# EAGLE schematic MSP-EXP430F5529LP (EAGLE 6.4)

## Sheet 1 of 4
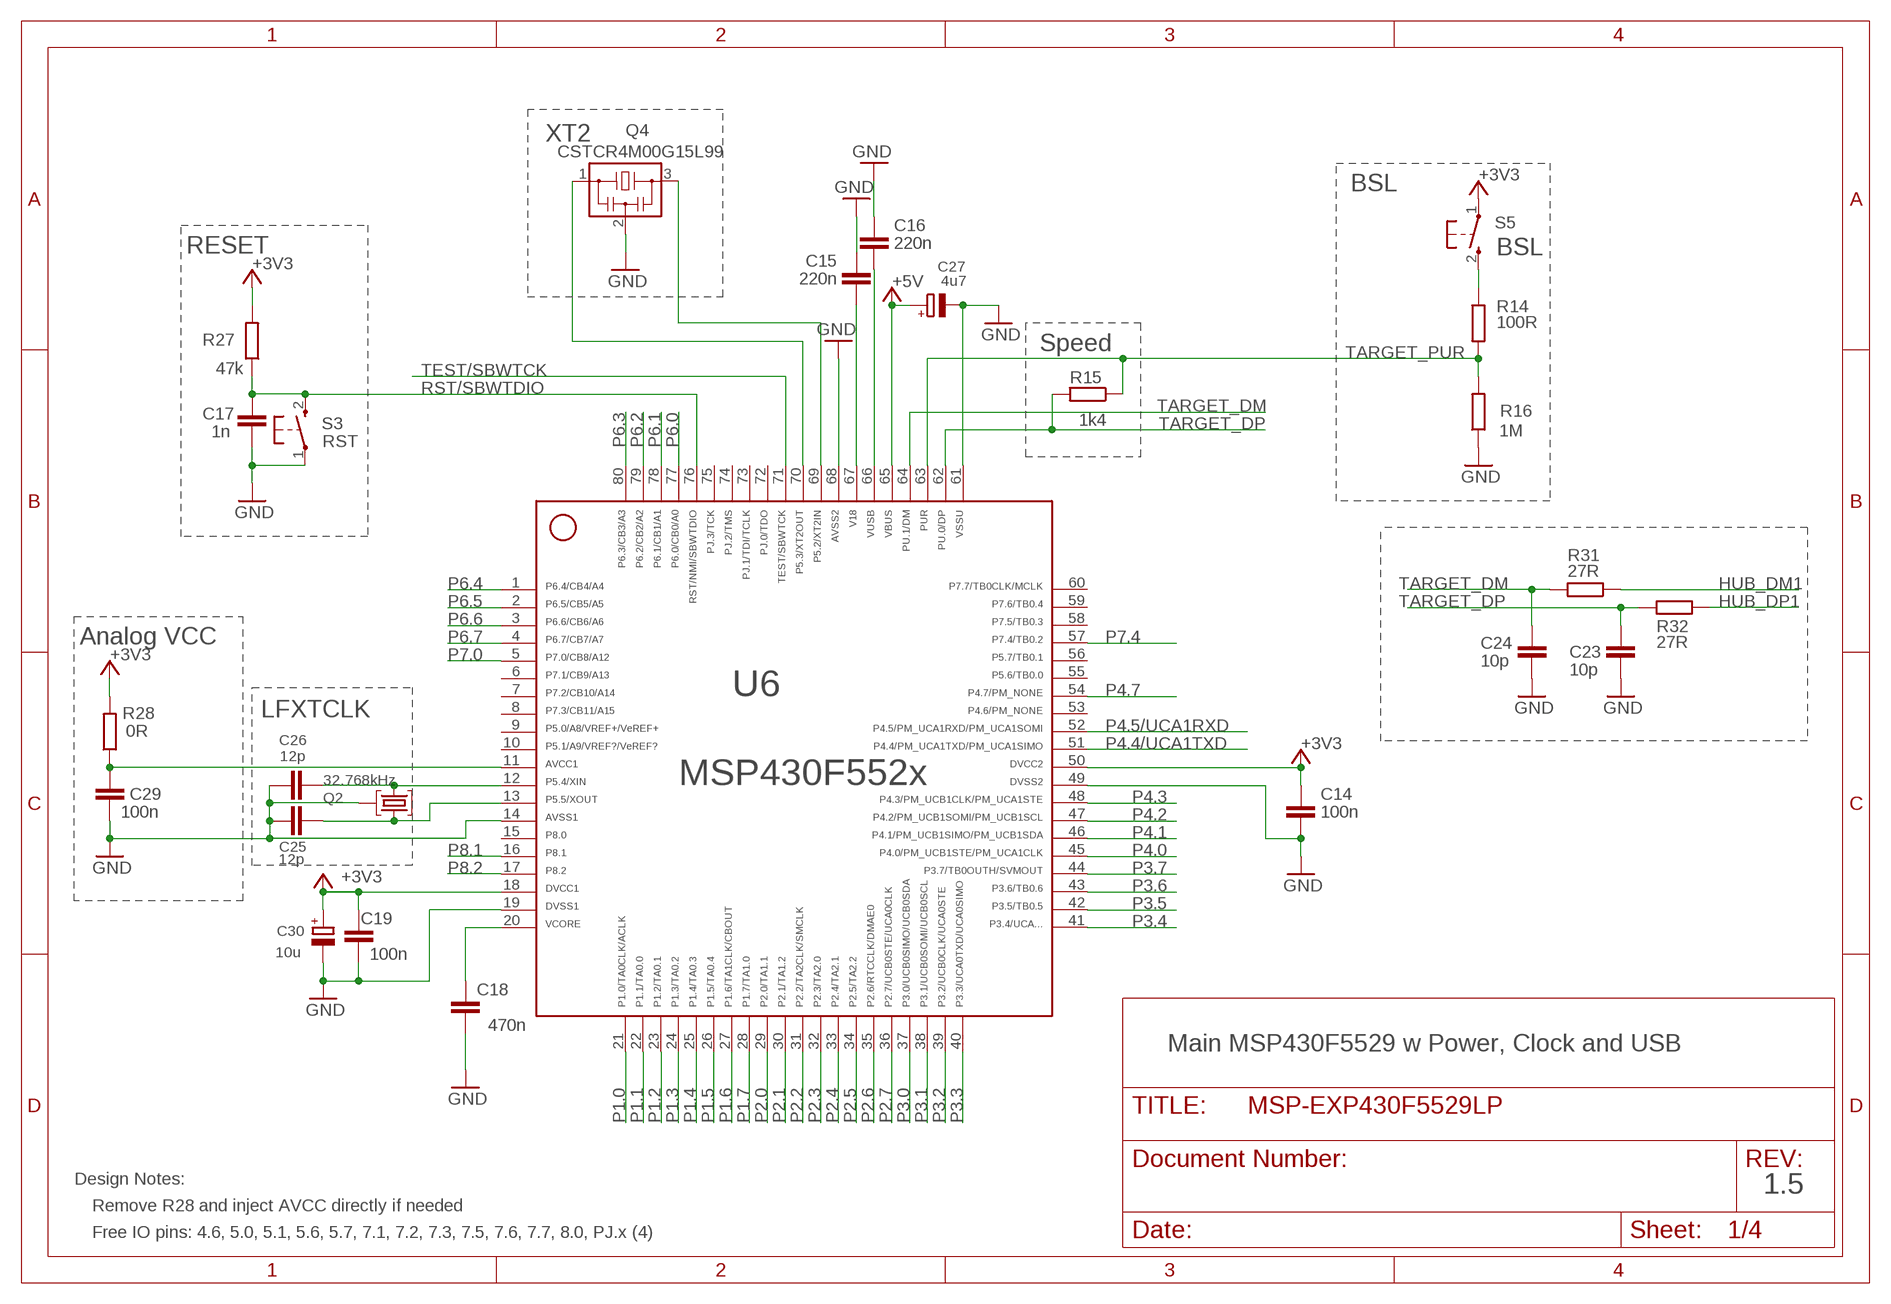
[diagram p0: schematic, sheet 1]

### Parts
C14  100n  C-EUC0402  [C0402]
C15  220n  C-EUC0402  [C0402]
C16  220n  C-EUC0402  [C0402]
C17  1n  C-EUC0402  [C0402]
C18  470n  C-EUC0402  [C0402]
C19  100n  C-EUC0402  [C0402]
C23  10p  C-EUC0402  [C0402]
C24  10p  C-EUC0402  [C0402]
C25  12p  C-EUC0402  [C0402]
C26  12p  C-EUC0402  [C0402]
C27  4u7  CPOL-EUA/3216-18R  [A/3216-18R]
C29  100n  C-EUC0402  [C0402]
C30  10u  CPOL-EUA/3216-18R  [A/3216-18R]
Q2  32.768kHz  MS3V-T1R  [MS3V-T1R]
Q4  CSTCR4M00G15L99  MURATA-FILTER_CSTCR6M00G53Z  [MURATA-FILTER_CSTCR]
R14  100R  R-EU_R0402  [R0402]
R15  1k4  R-EU_R0402  [R0402]
R16  1M  R-EU_R0402  [R0402]
R27  47k  R-EU_R0402  [R0402]
R28  0R  R-EU_R0402  [R0402]
R31  27R  R-EU_R0402  [R0402]
R32  27R  R-EU_R0402  [R0402]
S3  RST  PB  [PBTH]
S5  BSL  PB  [PBTH]
U6  MSP430F5529IPNR  F552X---PN80  [PN80]

### Nets
+3V3 [Power]: C14.1 C19.2 C30.+ R27.2 R28.2 S5.1(P) U6.18 U6.50 ; also sheet 2
+5V [Power]: C27.+ U6.65 ; also sheet 2
AVCC [Power]: C29.1 R28.1 U6.11
GND [Ground]: C14.2 C15.2 C16.2 C17.2 C18.1 C19.1 C23.2 C24.2 C25.1 C26.1 C27.- C29.2 C30.- Q2.P3(GND) Q4.2 R16.1 S3.1(P) U6.14 U6.19 U6.49 U6.61 U6.68 ; also sheet 2,3,4
HUB_DM1: R31.1 ; also sheet 4
HUB_DP1: R32.1 ; also sheet 4
N$4: R14.1 S5.2(S)
P1.0: U6.21 ; also sheet 2
P1.1: U6.22 ; also sheet 2
P1.2: U6.23 ; also sheet 2
P1.3: U6.24 ; also sheet 2
P1.4: U6.25 ; also sheet 2
P1.5: U6.26 ; also sheet 2
P1.6: U6.27 ; also sheet 2
P1.7: U6.28 ; also sheet 2
P2.0: U6.29 ; also sheet 2
P2.1: U6.30 ; also sheet 2
P2.2: U6.31 ; also sheet 2
P2.3: U6.32 ; also sheet 2
P2.4: U6.33 ; also sheet 2
P2.5: U6.34 ; also sheet 2
P2.6: U6.35 ; also sheet 2
P2.7: U6.36 ; also sheet 2
P3.0: U6.37 ; also sheet 2
P3.1: U6.38 ; also sheet 2
P3.2: U6.39 ; also sheet 2
P3.3: U6.40 ; also sheet 2
P3.4: U6.41 ; also sheet 2
P3.5: U6.42 ; also sheet 2
P3.6: U6.43 ; also sheet 2
P3.7: U6.44 ; also sheet 2
P4.0: U6.45 ; also sheet 2
P4.1: U6.46 ; also sheet 2
P4.2: U6.47 ; also sheet 2
P4.3: U6.48 ; also sheet 2
P4.4/UCA1TXD: U6.51 ; also sheet 2
P4.5/UCA1RXD: U6.52 ; also sheet 2
P4.7: U6.54 ; also sheet 2
P5.2/XT2IN: Q4.3 U6.69
P5.3/XT2OUT: Q4.1 U6.70
P5.4/XIN: C26.2 Q2.P2 U6.12
P5.5/XOUT: C25.2 Q2.P1 U6.13
P6.0: U6.77 ; also sheet 2
P6.1: U6.78 ; also sheet 2
P6.2: U6.79 ; also sheet 2
P6.3: U6.80 ; also sheet 2
P6.4: U6.1 ; also sheet 2
P6.5: U6.2 ; also sheet 2
P6.6: U6.3 ; also sheet 2
P6.7: U6.4 ; also sheet 2
P7.0: U6.5 ; also sheet 2
P7.4: U6.57 ; also sheet 2
P8.1: U6.16 ; also sheet 2
P8.2: U6.17 ; also sheet 2
RST/SBWTDIO: C17.1 R27.1 S3.2(S) U6.76 ; also sheet 2
TARGET_DM: C24.1 R31.2 U6.64
TARGET_DP: C23.1 R15.2 R32.2 U6.62
TARGET_PUR: R14.2 R15.1 R16.2 U6.63
TARGET_VUSB [Power]: C16.1 U6.66
TEST/SBWTCK: U6.71 ; also sheet 2
V18 [Power]: C15.1 U6.67
VCORE [Power]: C18.2 U6.20
Unconnected: U6.6 U6.7 U6.8 U6.9 U6.10 U6.15 U6.53 U6.55 U6.56 U6.58 U6.59 U6.60 U6.72 U6.73 U6.74 U6.75

### Notes on the sheet
- XT2
- BSL
- RESET
- Speed
- Analog VCC
- LFXTCLK
- Main MSP430F5529 w Power, Clock and USB
- Design Notes:
- 1.5
- Remove R28 and inject AVCC directly if needed
- Free IO pins: 4.6, 5.0, 5.1, 5.6, 5.7, 7.1, 7.2, 7.3, 7.5, 7.6, 7.7, 8.0, PJ.x (4)

## Sheet 2 of 4
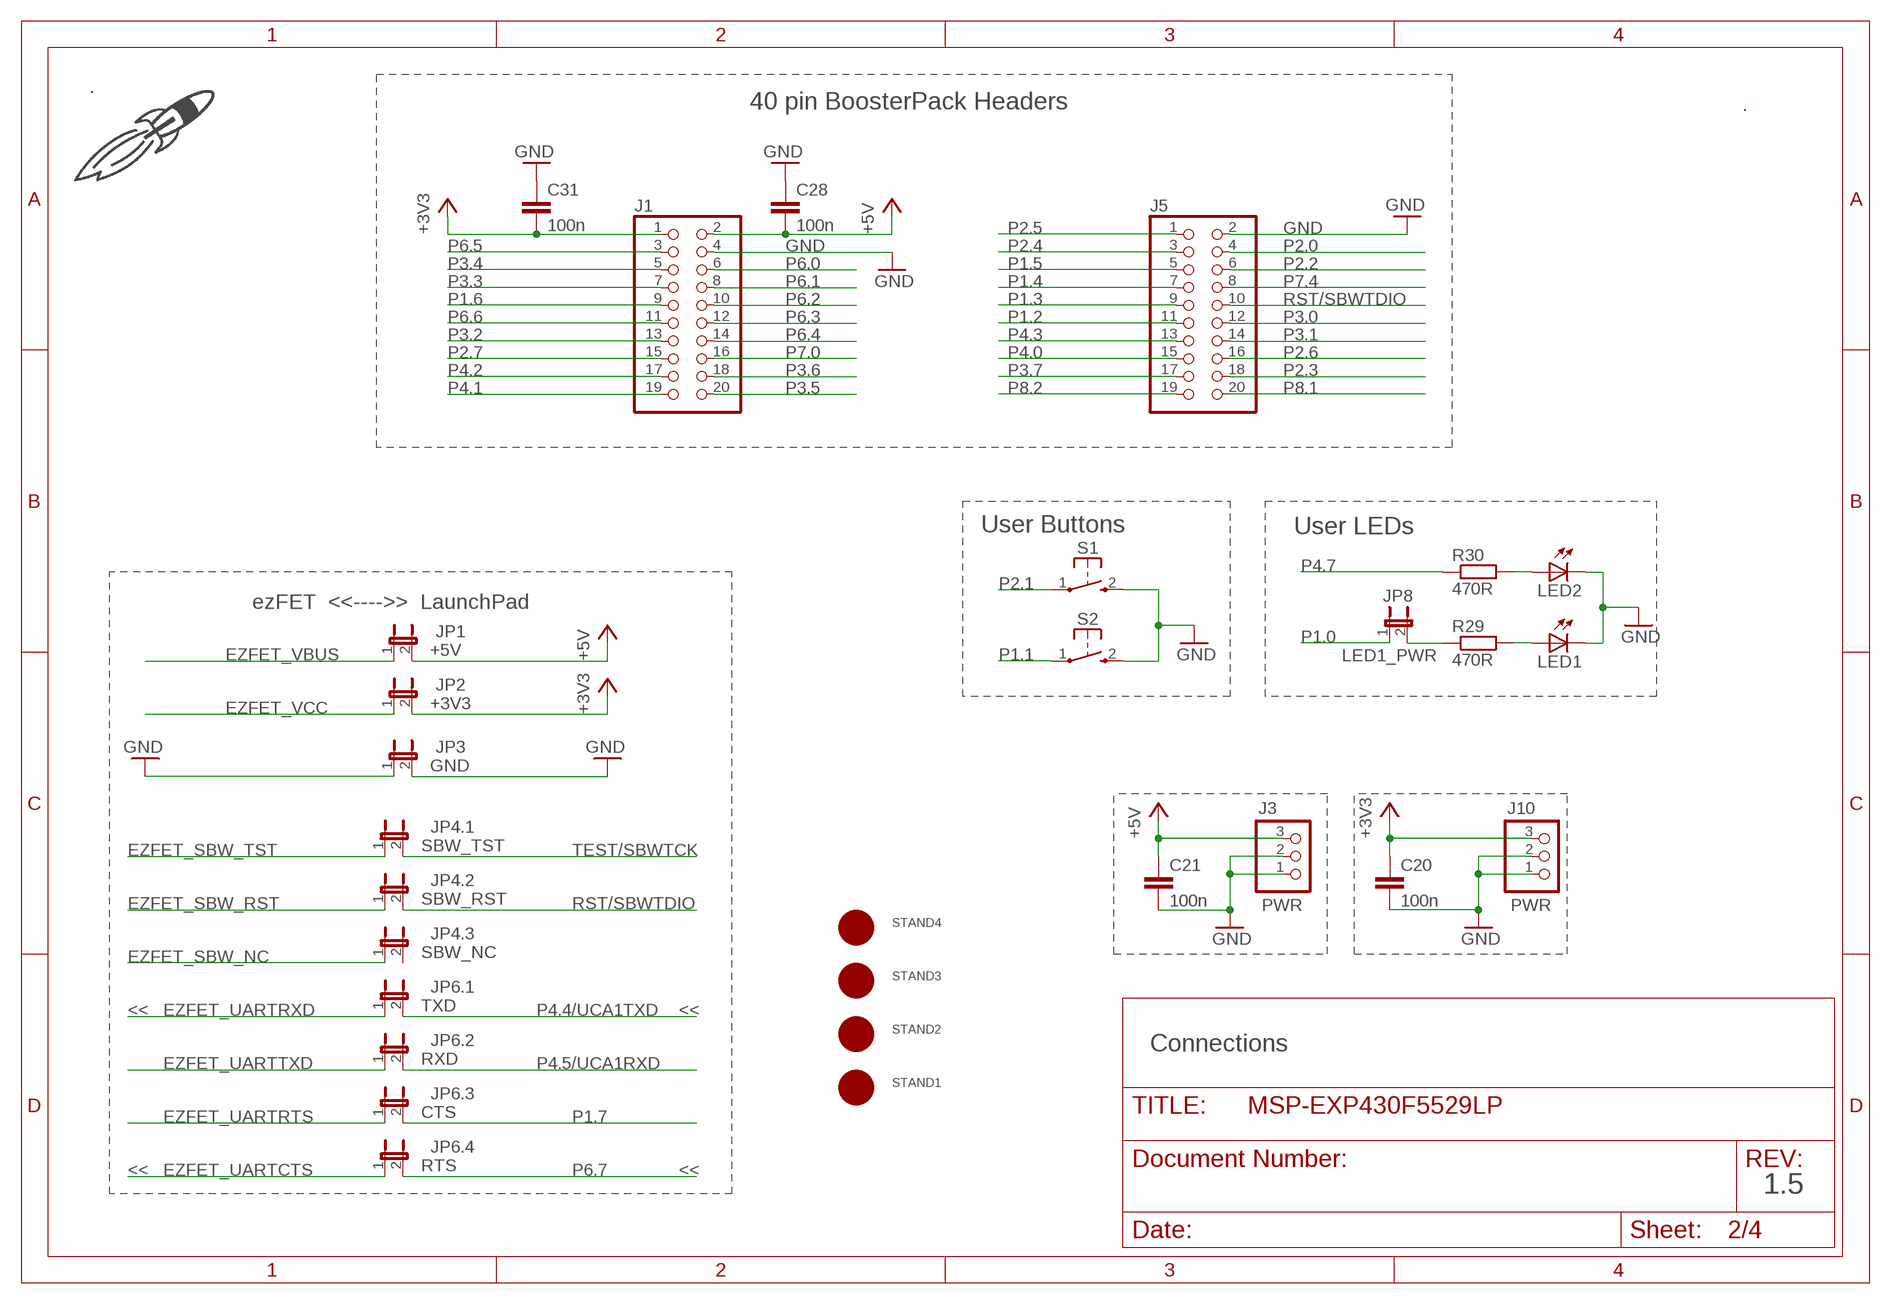
[diagram p1: schematic, sheet 2]

### Parts
C20  100n  C-EUC0402  [C0402]
C21  100n  C-EUC0402  [C0402]
C28  100n  C-EUC0402  [C0402]
C31  100n  C-EUC0402  [C0402]
DRAW1  LOGO-ROCKET-20X13MM-SCH-S  [LOGO-ROCKET-10X7MM-BRD]
J1  PINHD-2X10  [2X10]
J3  PWR  PINHD-1X3  [1X03]
J5  PINHD-2X10  [2X10]
J10  PWR  PINHD-1X3  [1X03]
JP1  +5V  JP1M  [JP1M]
JP2  +3V3  JP1M  [JP1M]
JP3  GND  JP1M  [JP1M]
JP4.1  SBW_TST  JP1M  [JP1M]
JP4.2  SBW_RST  JP1M  [JP1M]
JP4.3  SBW_NC  JP1M  [JP1M]
JP6.1  TXD  JP1M  [JP1M]
JP6.2  RXD  JP1M  [JP1M]
JP6.3  CTS  JP1M  [JP1M]
JP6.4  RTS  JP1M  [JP1M]
JP8  LED1_PWR  JP1E  [JP1]
LED1  LEDCHIPLED_0603  [CHIPLED_0603]
LED2  LEDCHIPLED_0603  [CHIPLED_0603]
R29  470R  R-EU_R0402  [R0402]
R30  470R  R-EU_R0402  [R0402]
S1  PB  [PBTH]
S2  PB  [PBTH]
STAND1  MOUNT  [MOUNTHOLE_110MIL]
STAND2  MOUNT  [MOUNTHOLE_110MIL]
STAND3  MOUNT  [MOUNTHOLE_110MIL]
STAND4  MOUNT  [MOUNTHOLE_110MIL]
U$3  5529_REAR_SILK_REV1_5_FINAL  [5529_REAR_SILK_REV1_5_FINAL]
U$4  MS_TM  [MS_TM]

### Nets
+3V3 [Power]: C20.1 C31.2 J1.1 J10.3 JP2.2 ; also sheet 1
+5V [Power]: C21.1 C28.2 J1.2 J3.3 JP1.2 ; also sheet 1
EZFET_SBW_NC: JP4.3.1 ; also sheet 3
EZFET_SBW_RST: JP4.2.1 ; also sheet 3
EZFET_SBW_TST: JP4.1.1 ; also sheet 3
EZFET_UARTCTS: JP6.4.1 ; also sheet 3
EZFET_UARTRTS: JP6.3.1 ; also sheet 3
EZFET_UARTRXD: JP6.1.1 ; also sheet 3
EZFET_UARTTXD: JP6.2.1 ; also sheet 3
EZFET_VBUS [Power]: JP1.1 ; also sheet 3,4
EZFET_VCC [Power]: JP2.1 ; also sheet 3,4
GND [Ground]: C20.2 C21.2 C28.1 C31.1 J1.4 J3.1 J3.2 J5.2 J10.1 J10.2 JP3.1 JP3.2 LED1.C LED2.C S1.2(S) S2.2(S) ; also sheet 1,3,4
N$7: JP8.2 R29.1
N$32: LED1.A R29.2
N$35: LED2.A R30.2
P1.0: JP8.1 ; also sheet 1
P1.1: S2.1(P) ; also sheet 1
P1.2: J5.11 ; also sheet 1
P1.3: J5.9 ; also sheet 1
P1.4: J5.7 ; also sheet 1
P1.5: J5.5 ; also sheet 1
P1.6: J1.9 ; also sheet 1
P1.7: JP6.3.2 ; also sheet 1
P2.0: J5.4 ; also sheet 1
P2.1: S1.1(P) ; also sheet 1
P2.2: J5.6 ; also sheet 1
P2.3: J5.18 ; also sheet 1
P2.4: J5.3 ; also sheet 1
P2.5: J5.1 ; also sheet 1
P2.6: J5.16 ; also sheet 1
P2.7: J1.15 ; also sheet 1
P3.0: J5.12 ; also sheet 1
P3.1: J5.14 ; also sheet 1
P3.2: J1.13 ; also sheet 1
P3.3: J1.7 ; also sheet 1
P3.4: J1.5 ; also sheet 1
P3.5: J1.20 ; also sheet 1
P3.6: J1.18 ; also sheet 1
P3.7: J5.17 ; also sheet 1
P4.0: J5.15 ; also sheet 1
P4.1: J1.19 ; also sheet 1
P4.2: J1.17 ; also sheet 1
P4.3: J5.13 ; also sheet 1
P4.4/UCA1TXD: JP6.1.2 ; also sheet 1
P4.5/UCA1RXD: JP6.2.2 ; also sheet 1
P4.7: R30.1 ; also sheet 1
P6.0: J1.6 ; also sheet 1
P6.1: J1.8 ; also sheet 1
P6.2: J1.10 ; also sheet 1
P6.3: J1.12 ; also sheet 1
P6.4: J1.14 ; also sheet 1
P6.5: J1.3 ; also sheet 1
P6.6: J1.11 ; also sheet 1
P6.7: JP6.4.2 ; also sheet 1
P7.0: J1.16 ; also sheet 1
P7.4: J5.8 ; also sheet 1
P8.1: J5.20 ; also sheet 1
P8.2: J5.19 ; also sheet 1
RST/SBWTDIO: J5.10 JP4.2.2 ; also sheet 1
TEST/SBWTCK: JP4.1.2 ; also sheet 1
Unconnected: JP4.3.2

### Notes on the sheet
- 40 pin BoosterPack Headers
- User Buttons | User LEDs
- ezFET  <<---->>  LaunchPad
- << | <<
- Connections
- << | <<
- 1.5

## Sheet 3 of 4
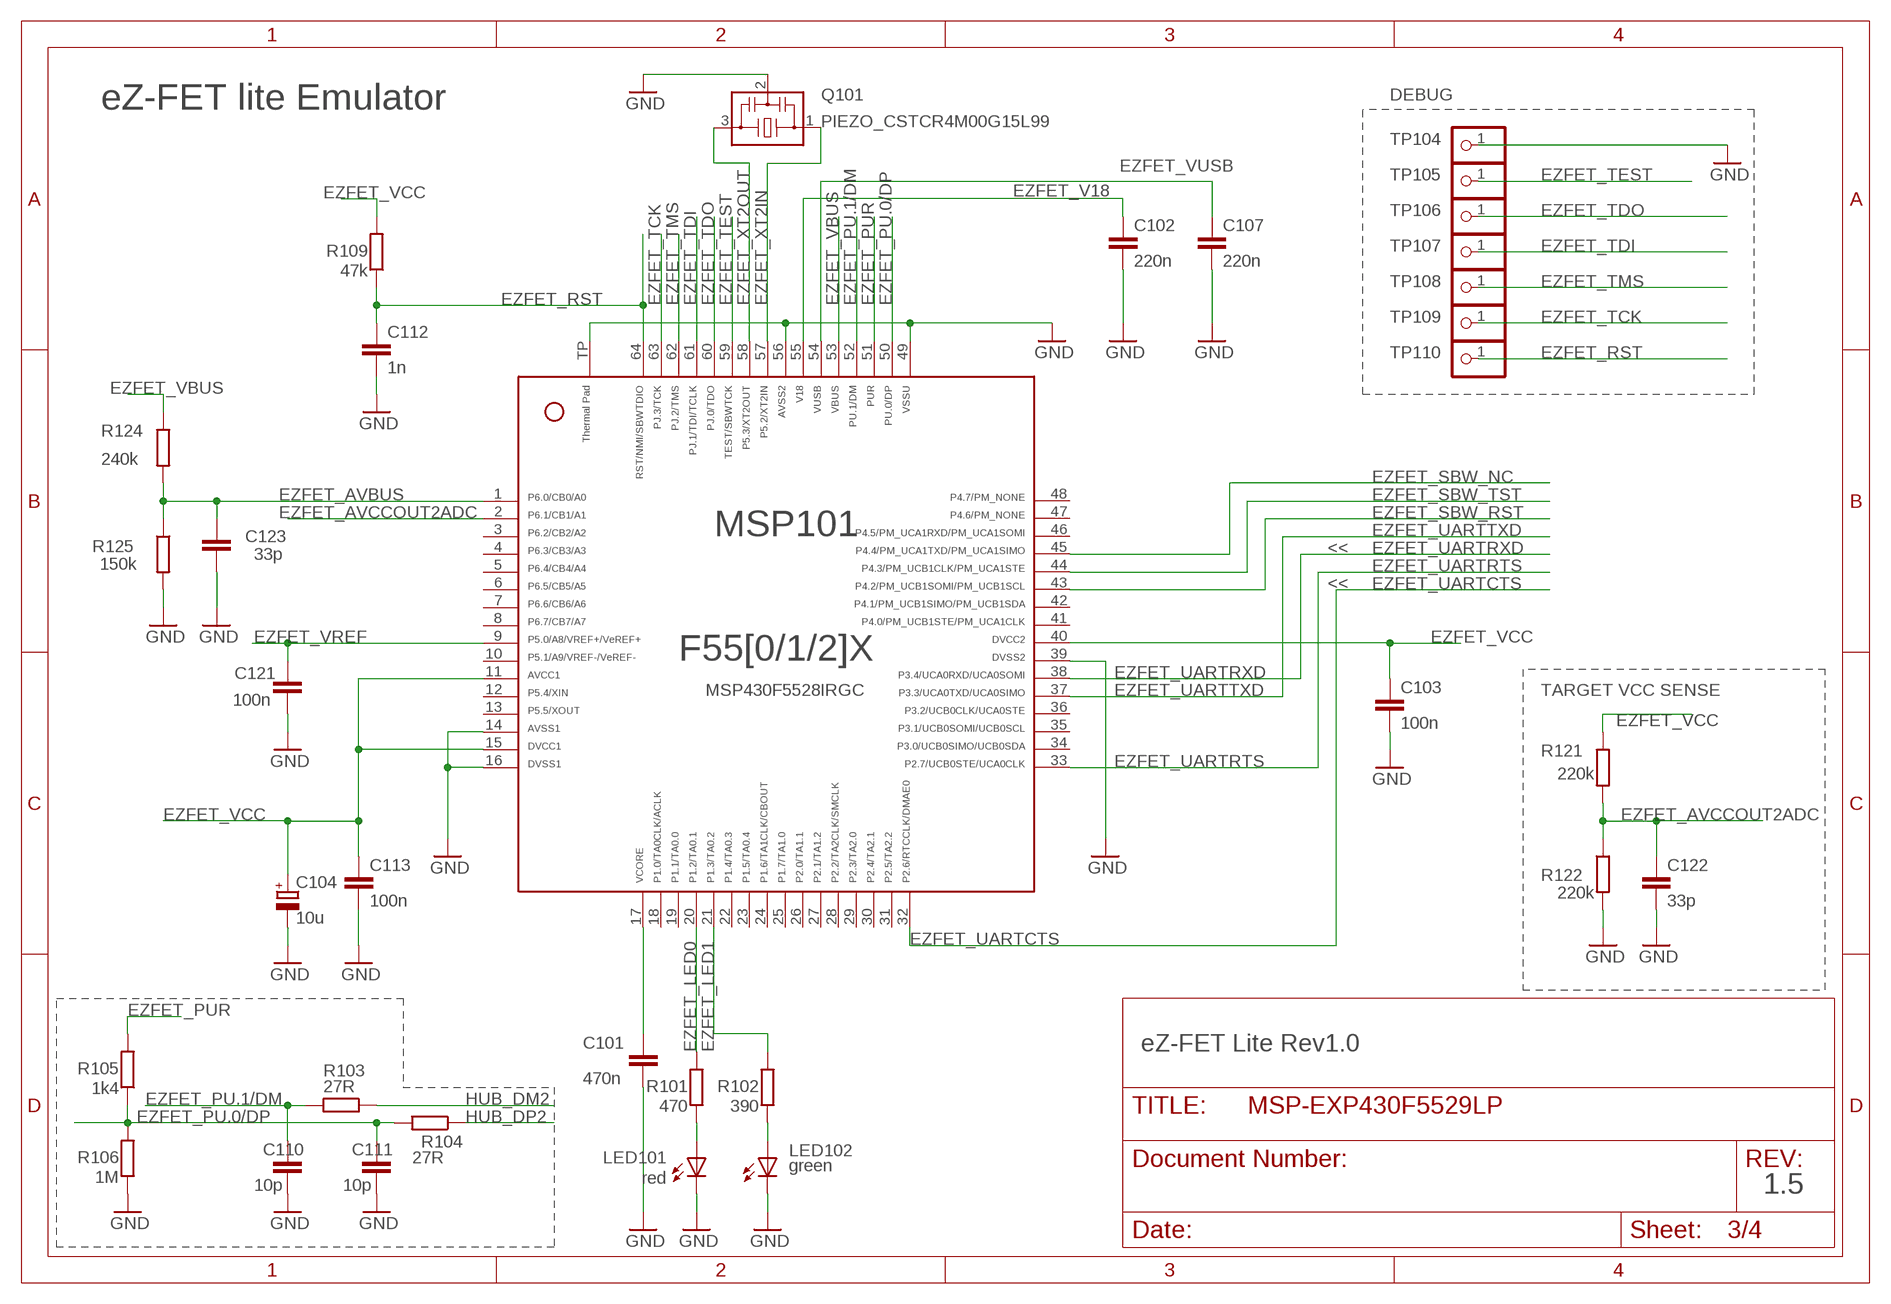
[diagram p2: schematic, sheet 3]

### Parts
C101  470n  C-EUC0402  [C0402]
C102  220n  C-EUC0402  [C0402]
C103  100n  C-EUC0402  [C0402]
C104  10u  CPOL-EUA/3216-18R  [A/3216-18R]
C107  220n  C-EUC0402  [C0402]
C110  10p  C-EUC0402  [C0402]
C111  10p  C-EUC0402  [C0402]
C112  1n  C-EUC0402  [C0402]
C113  100n  C-EUC0402  [C0402]
C121  100n  C-EUC0402  [C0402]
C122  33p  C-EUC0402  [C0402]
C123  33p  C-EUC0402  [C0402]
LED101  red  LEDCHIP-LED0603  [CHIP-LED0603]
LED102  green  LEDCHIP-LED0603  [CHIP-LED0603]
MSP101  MSP430F5528IRGC  F55[0/1/2]X---RGC64  [RGC64]
Q101  PIEZO_CSTCR4M00G15L99  MURATA-FILTER_CSTCR6M00G53Z  [MURATA-FILTER_CSTCR]
R101  470  R-EU_R0402  [R0402]
R102  390  R-EU_R0402  [R0402]
R103  27R  R-EU_R0402  [R0402]
R104  27R  R-EU_R0402  [R0402]
R105  1k4  R-EU_R0402  [R0402]
R106  1M  R-EU_R0402  [R0402]
R109  47k  R-EU_R0402  [R0402]
R121  220k  R-EU_R0402  [R0402]
R122  220k  R-EU_R0402  [R0402]
R124  240k  R-EU_R0402  [R0402]
R125  150k  R-EU_R0402  [R0402]
TP104  TEST_PIN2  PINHD-1X1  [1X01]
TP105  TEST_PIN2  PINHD-1X1  [1X01]
TP106  TEST_PIN2  PINHD-1X1  [1X01]
TP107  TEST_PIN2  PINHD-1X1  [1X01]
TP108  TEST_PIN2  PINHD-1X1  [1X01]
TP109  TEST_PIN2  PINHD-1X1  [1X01]
TP110  TEST_PIN2  PINHD-1X1  [1X01]

### Nets
EZFET_AVBUS: C123.2 MSP101.1 R124.2 R125.1
EZFET_AVCCOUT2ADC: C122.2 MSP101.2 R121.2 R122.1
EZFET_LED0: MSP101.20 R101.2
EZFET_LED1: MSP101.21 R102.2
EZFET_PU.0/DP: C111.1 MSP101.50 R104.2 R105.1 R106.2
EZFET_PU.1/DM: C110.1 MSP101.52 R103.2
EZFET_PUR: MSP101.51 R105.2
EZFET_RST: C112.1 MSP101.64 R109.1 TP110.1
EZFET_SBW_NC: MSP101.45 ; also sheet 2
EZFET_SBW_RST: MSP101.43 ; also sheet 2
EZFET_SBW_TST: MSP101.44 ; also sheet 2
EZFET_TCK: MSP101.63 TP109.1
EZFET_TDI: MSP101.61 TP107.1
EZFET_TDO: MSP101.60 TP106.1
EZFET_TEST: MSP101.59 TP105.1
EZFET_TMS: MSP101.62 TP108.1
EZFET_UARTCTS: MSP101.32 ; also sheet 2
EZFET_UARTRTS: MSP101.33 ; also sheet 2
EZFET_UARTRXD: MSP101.38 ; also sheet 2
EZFET_UARTTXD: MSP101.37 ; also sheet 2
EZFET_V18 [Power]: C102.1 MSP101.55
EZFET_VBUS [Power]: MSP101.53 R124.1 ; also sheet 2,4
EZFET_VCC [Power]: C103.1 C104.+ C113.1 MSP101.11 MSP101.15 MSP101.40 R109.2 R121.1 ; also sheet 2,4
EZFET_VREF [Power]: C121.1 MSP101.9
EZFET_VUSB [Power]: C107.1 MSP101.54
EZFET_XT2IN: MSP101.57 Q101.1
EZFET_XT2OUT: MSP101.58 Q101.3
GND [Ground]: C101.2 C102.2 C103.2 C104.- C107.2 C110.2 C111.2 C112.2 C113.2 C121.2 C122.1 C123.1 LED101.C LED102.C MSP101.14 MSP101.16 MSP101.39 MSP101.49 MSP101.56 MSP101.TP Q101.2 R106.1 R122.2 R125.2 TP104.1 ; also sheet 1,2,4
HUB_DM2: R103.1 ; also sheet 4
HUB_DP2: R104.1 ; also sheet 4
N$1: LED101.A R101.1
N$2: LED102.A R102.1
N$8: C101.1 MSP101.17
Unconnected: MSP101.3 MSP101.4 MSP101.5 MSP101.6 MSP101.7 MSP101.8 MSP101.10 MSP101.12 MSP101.13 MSP101.18 MSP101.19 MSP101.22 MSP101.23 MSP101.24 MSP101.25 MSP101.26 MSP101.27 MSP101.28 MSP101.29 MSP101.30 MSP101.31 MSP101.34 MSP101.35 MSP101.36 MSP101.41 MSP101.42 MSP101.46 MSP101.47 MSP101.48

### Notes on the sheet
- DEBUG
- eZ-FET lite Emulator
- <<
- <<
- MSP430F5528IRGC | TARGET VCC SENSE
- eZ-FET Lite Rev1.0
- 1.5

## Sheet 4 of 4
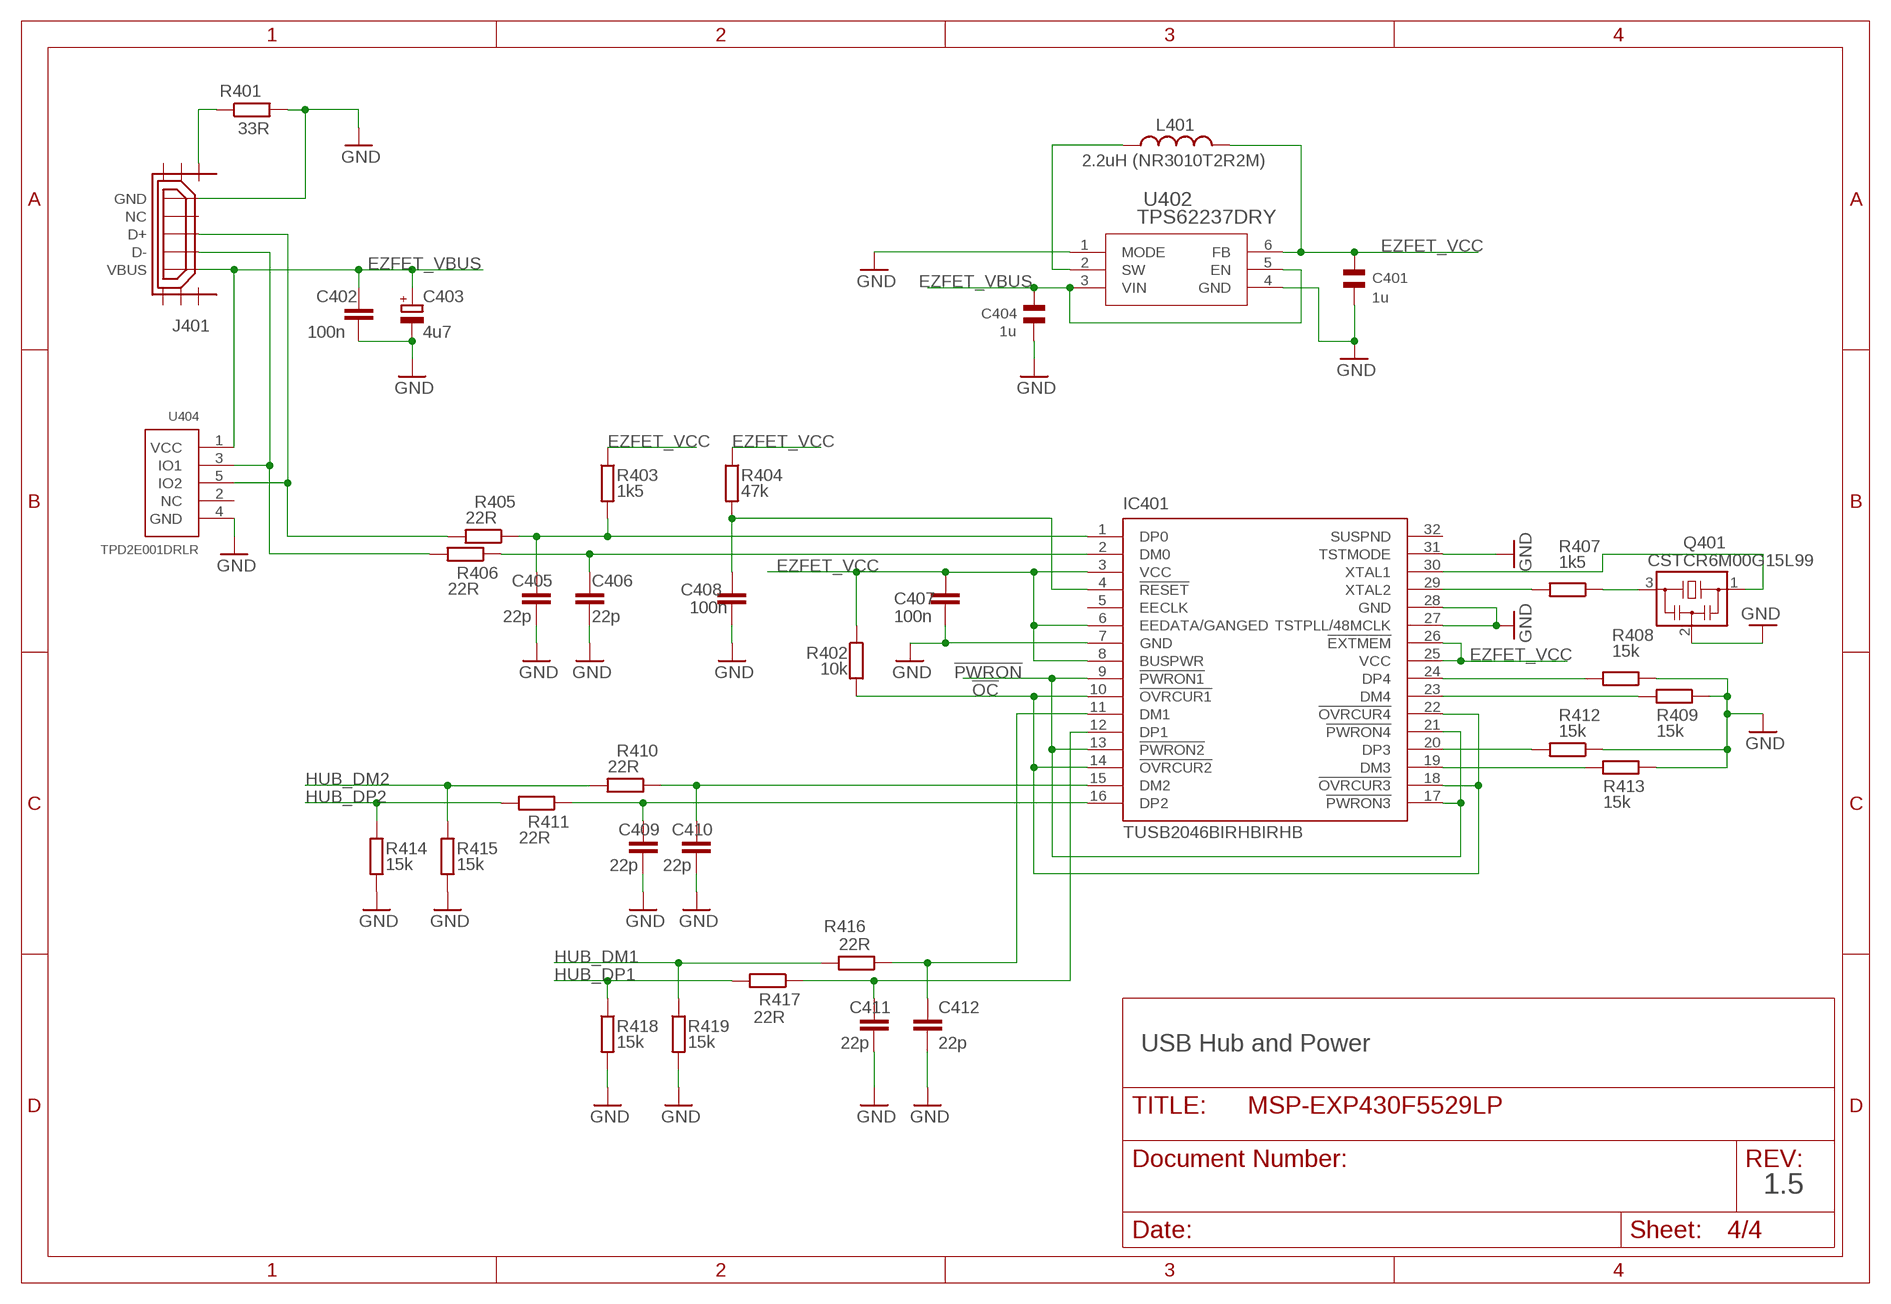
[diagram p3: schematic, sheet 4]

### Parts
C401  1u  CSMD0805  [CSMD0805]
C402  100n  C-EUC0402  [C0402]
C403  4u7  CPOL-EUA/3216-18R  [A/3216-18R]
C404  1u  CSMD0805  [CSMD0805]
C405  22p  C-EUC0402  [C0402]
C406  22p  C-EUC0402  [C0402]
C407  100n  C-EUC0402  [C0402]
C408  100n  C-EUC0402  [C0402]
C409  22p  C-EUC0402  [C0402]
C410  22p  C-EUC0402  [C0402]
C411  22p  C-EUC0402  [C0402]
C412  22p  C-EUC0402  [C0402]
IC401  TUSB2046BIRHBIRHB  [RHB_S-PQFP-N32]
J401  USB_MICRO_FLIPPED  [HIROSE-ZX62R-B-5P]
L401  2.2uH (NR3010T2R2M)  L-NR3010  [L-NR3010]
Q401  CSTCR6M00G15L99  MURATA-FILTER_CSTCR6M00G53Z  [MURATA-FILTER_CSTCR]
R401  33R  R-EU_R0402  [R0402]
R402  10k  R-EU_R0402  [R0402]
R403  1k5  R-EU_R0402  [R0402]
R404  47k  R-EU_R0402  [R0402]
R405  22R  R-EU_R0402  [R0402]
R406  22R  R-EU_R0402  [R0402]
R407  1k5  R-EU_R0402  [R0402]
R408  15k  R-EU_R0402  [R0402]
R409  15k  R-EU_R0402  [R0402]
R410  22R  R-EU_R0402  [R0402]
R411  22R  R-EU_R0402  [R0402]
R412  15k  R-EU_R0402  [R0402]
R413  15k  R-EU_R0402  [R0402]
R414  15k  R-EU_R0402  [R0402]
R415  15k  R-EU_R0402  [R0402]
R416  22R  R-EU_R0402  [R0402]
R417  22R  R-EU_R0402  [R0402]
R418  15k  R-EU_R0402  [R0402]
R419  15k  R-EU_R0402  [R0402]
U402  TPS62237DRY  TPS6223X_DRY_6  [DRY6]
U404  TPD2E001DRLR  TPD2E001  [TPD2E001-DRL]

### Nets
!OC: IC401.10(!OVRCUR1) IC401.14(!OVRCUR2) IC401.18(!OVRCUR3) IC401.22(!OVRCUR4) R402.2
!PWRON: IC401.9(!PWRON1) IC401.13(!PWRON2) IC401.17(!PWRON3) IC401.21(!PWRON4)
EZFET_VBUS [Power]: C402.1 C403.+ C404.2 J401.VBUS U402.3(VIN) U402.5(EN) U404.1(VCC) ; also sheet 2,3
EZFET_VCC [Power]: C401.2 C407.1 IC401.3(VCC) IC401.6(EEDATA/GANGED) IC401.8(BUSPWR) IC401.25(VCC) IC401.26(!EXTMEM) L401.P$2 R402.1 R403.1 R404.1 U402.6(FB) ; also sheet 2,3
GND [Ground]: C401.1 C402.2 C403.- C404.1 C405.2 C406.2 C407.2 C408.2 C409.2 C410.2 C411.2 C412.2 IC401.7(GND) IC401.27(TSTPLL/48MCLK) IC401.28(GND) IC401.31(TSTMODE) J401.GND Q401.2 R401.2 R408.1 R409.1 R412.1 R413.1 R414.2 R415.2 R418.2 R419.2 U402.1(MODE) U402.4(GND) U404.4(GND) ; also sheet 1,2,3
HUB_DM1: R416.2 R419.1 ; also sheet 1
HUB_DM2: R410.2 R415.1 ; also sheet 3
HUB_DP1: R417.2 R418.1 ; also sheet 1
HUB_DP2: R411.2 R414.1 ; also sheet 3
N$3: C410.1 IC401.15(DM2) R410.1
N$5: C405.1 IC401.1(DP0) R403.2 R405.1
N$6: IC401.30(XTAL1) Q401.1
N$10: J401.SHIELD1 R401.1
N$11: C406.1 IC401.2(DM0) R406.1
N$12: J401.D+ R405.2 U404.5(IO2)
N$13: J401.D- R406.2 U404.3(IO1)
N$14: L401.P$1 U402.2(SW)
N$15: IC401.29(XTAL2) R407.2
N$16: C412.1 IC401.11(DM1) R416.1
N$17: C411.1 IC401.12(DP1) R417.1
N$18: C409.1 IC401.16(DP2) R411.1
N$19: C408.1 IC401.4(!RESET) R404.2
N$20: IC401.20(DP3) R412.2
N$21: IC401.24(DP4) R408.2
N$22: IC401.23(DM4) R409.2
N$23: IC401.19(DM3) R413.2
N$28: Q401.3 R407.1
Unconnected: IC401.5(EECLK) IC401.32(SUSPND) IC401.EXP IC401.EXP@1(EXP) IC401.EXP@2(EXP) IC401.EXP@3(EXP) IC401.EXP@4(EXP) IC401.EXP@5(EXP) IC401.EXP@6(EXP) IC401.EXP@7(EXP) IC401.EXP@8(EXP) IC401.EXP@9(EXP) J401.NC J401.SHIELD2 J401.SHIELD3 J401.SHIELD4 J401.SHIELD5 J401.SHIELD6 U404.2(NC)

### Notes on the sheet
- USB Hub and Power
- 1.5

## Library data of the parts
C14-C21 C23-C26 C28 C29 C31 C101-C103 C107 C110-C113 C121-C123 C402 C405-C412 = rcl:C-EU: CAPACITOR, European symbol
C27 C30 C104 C403 = rcl:CPOL-EU: POLARIZED CAPACITOR, European symbol
C401 C404 = CAP:CSMD0805
DRAW1 = TI-LaunchPad-Eagle:LOGO-ROCKET-20X13MM-SCH: TI LaunchPad Rocket for Schematic and Layout Based on TI's LaunchPad Rocket from www.ti.com/LaunchPad Usage: Place this component in the Eagle Schematic This symbol has a footprint too, so it will show up in the layout too There are different sizes / footprints available The PCB symbol size can be changed via package in schematic or the layout As far as I know the LaunchPad rocket is released by TI under the Creative Commons license. Check for updates and leave me feedback: github.com/ucdude Happy hacking - ucDude, Nov 2012
IC401 = texas:TUSB2046BIRHB: 4-PORT HUB FOR THE UNIVERSAL SERIAL BUS WITH OPTIONAL SERIAL EEPROM INTERFACE Source: http://focus.ti.com/lit/ds/symlink/tusb2046b.pdf; MPN: TUSB2046BIRHBT; OC_FARNELL: 1610201; OC_NEWARK: 14N8499
J1 J5 = pinhead:PINHD-2X10: PIN HEADER
J3 J10 = pinhead:PINHD-1X3: PIN HEADER
J401 = usb_con-update:USB_MICRO_FLIPPED
JP1-JP3 JP4.1-JP4.3 JP6.1-JP6.4 = jumper:JP1M
JP8 = jumper:JP1E: JUMPER
L401 = MSP-EXP430F5659:L-NR3010
LED1 LED2 LED101 LED102 = led:LED: LED OSRAM: - CHIPLED LG R971, LG N971, LY N971, LG Q971, LY Q971, LO R971, LY R971 LH N974, LH R974 LS Q976, LO Q976, LY Q976 LO Q996 - Hyper CHIPLED LW Q18S LB Q993, LB Q99A, LB R99A - SideLED LS A670, LO A670, LY A670, LG A670, LP A670 LB A673, LV A673, LT A673, LW A673 LH A674 LY A675 LS A676, LA A676, LO A676, LY A676, LW A676 LS A679, LY A679, LG A679 - Hyper Micro SIDELED® LS Y876, LA Y876, LO Y876, LY Y876 LT Y87S - SmartLED LW L88C, LW L88S LB L89C, LB L89S, LG L890 LS L89K, LO L89K, LY L89K LS L896, LA L896, LO L896, LY L896 - TOPLED LS T670, LO T670, LY T670, LG T670, LP T670 LSG T670, LSP T670, LSY T670, LOP T670, LYG T670 LG T671, LOG T671, LSG T671 LB T673, LV T673, LT T673, LW T673 LH T674 LS T676, LA T676, LO T676, LY T676, LB T676, LH T676, LSB T676, LW T676 LB T67C, LV T67C, LT T67C, LS T67K, LO T67K, LY T67K, LW E67C LS E67B, LA E67B, LO E67B, LY E67B, LB E67C, LV E67C, LT E67C LW T67C LS T679, LY T679, LG T679 LS T770, LO T770, LY T770, LG T770, LP T770 LB T773, LV T773, LT T773, LW T773 LH T774 LS E675, LA E675, LY E675, LS T675 LS T776, LA T776, LO T776, LY T776, LB T776 LHGB T686 LT T68C, LB T68C - Hyper Mini TOPLED® LB M676 - Mini TOPLED Santana® LG M470 LS M47K, LO M47K, LY M47K Source: http://www.osram.convergy.de LUXEON: - LUMILED® LXK2-PW12-R00, LXK2-PW12-S00, LXK2-PW14-U00, LXK2-PW14-V00 LXK2-PM12-R00, LXK2-PM12-S00, LXK2-PM14-U00 LXK2-PE12-Q00, LXK2-PE12-R00, LXK2-PE12-S00, LXK2-PE14-T00, LXK2-PE14-U00 LXK2-PB12-K00, LXK2-PB12-L00, LXK2-PB12-M00, LXK2-PB14-N00, LXK2-PB14-P00, LXK2-PB14-Q00 LXK2-PR12-L00, LXK2-PR12-M00, LXK2-PR14-Q00, LXK2-PR14-R00 LXK2-PD12-Q00, LXK2-PD12-R00, LXK2-PD12-S00 LXK2-PH12-R00, LXK2-PH12-S00 LXK2-PL12-P00, LXK2-PL12-Q00, LXK2-PL12-R00 Source: www.luxeon.com KINGBRIGHT: KA-3528ASYC Source: www.kingbright.com
MSP101 = TI_MSP430_v16_intern:F55[0/1/2]X---RGC64: ***F55[0/1/2]X***RGC64 Rev. 1.0 06/2010 "http://www.ti.com/lit/gpn/msp430f5529" "http://www.ti.com/lit/gpn/msp430f5509" F5513/F5514 with limited Functions on some Pins
Q2 = microcrystal:MS3V-T1R
Q4 Q101 Q401 = murata:MURATA-FILTER_CSTCR: Resonator Source: murata.co.jp; MPN: CSTCR6M00G53-R0; OC_FARNELL: 1170434; OC_NEWARK: 25M8759
R14-R16 R27-R32 R101-R106 R109 R121 R122 R124 R125 R401-R419 = rcl:R-EU_: RESISTOR, European symbol
S1-S3 S5 = electricalmeter:PB: OMRON SWITCH
STAND1-STAND4 = standoff:MOUNT
TP104-TP110 = pinhead:PINHD-1X1: PIN HEADER
U6 = TI_MSP430_v16_intern:F552X---PN80: ***MSP430F552X***PN80 http://www.ti.com/lit/gpn/msp430f5529 Rev1.0 06/2010 For F552X where X is 1,5,7,9
U402 = tps62231dry:TPS6223X_DRY_6; DATASHEETURL: http://www.ti.com/lit/gpn/TPS62231; DESCRIPTION: 3 MHz Ultra Small Step Down Converter in 1x1.5 SON Package; FAMILY_NAME: STEP-DOWN REGULATOR; GENERIC_PART_NUMBER: TPS62231; INDUSTRY_STD_PKG_TYPE: SON; MANUFACTURER: Texas Instruments; MANUFACTURER_PART_NUMBER: tps62231_dry_6; PACKAGE_DESIGNATOR: DRY; PIN_COUNT: 6; VALUE: TPS6223xDRY; VENDOR: Texas Instuments
U404 = Project7264:TPD2E001: TPD2E001 ESD-protection diode array
U$3 = LP_Silkscreen:5529_REAR_SILK_REV1_5_FINAL
U$4 = LP_Silkscreen:MS_TM

## Net classes
0 Default: width 0.203 mm, drill 0.305 mm, clearance 0.152 mm
1 Ground: width 0.203 mm, drill 0.305 mm, clearance 0.152 mm to class 0, clearance 0.152 mm
2 Power: width 0.203 mm, drill 0.305 mm, clearance 0.152 mm to class 0, clearance 0.152 mm to class 1, clearance 0.152 mm